# EAGLE design prize_delivery (EAGLE 9.6.2)
REV: 5
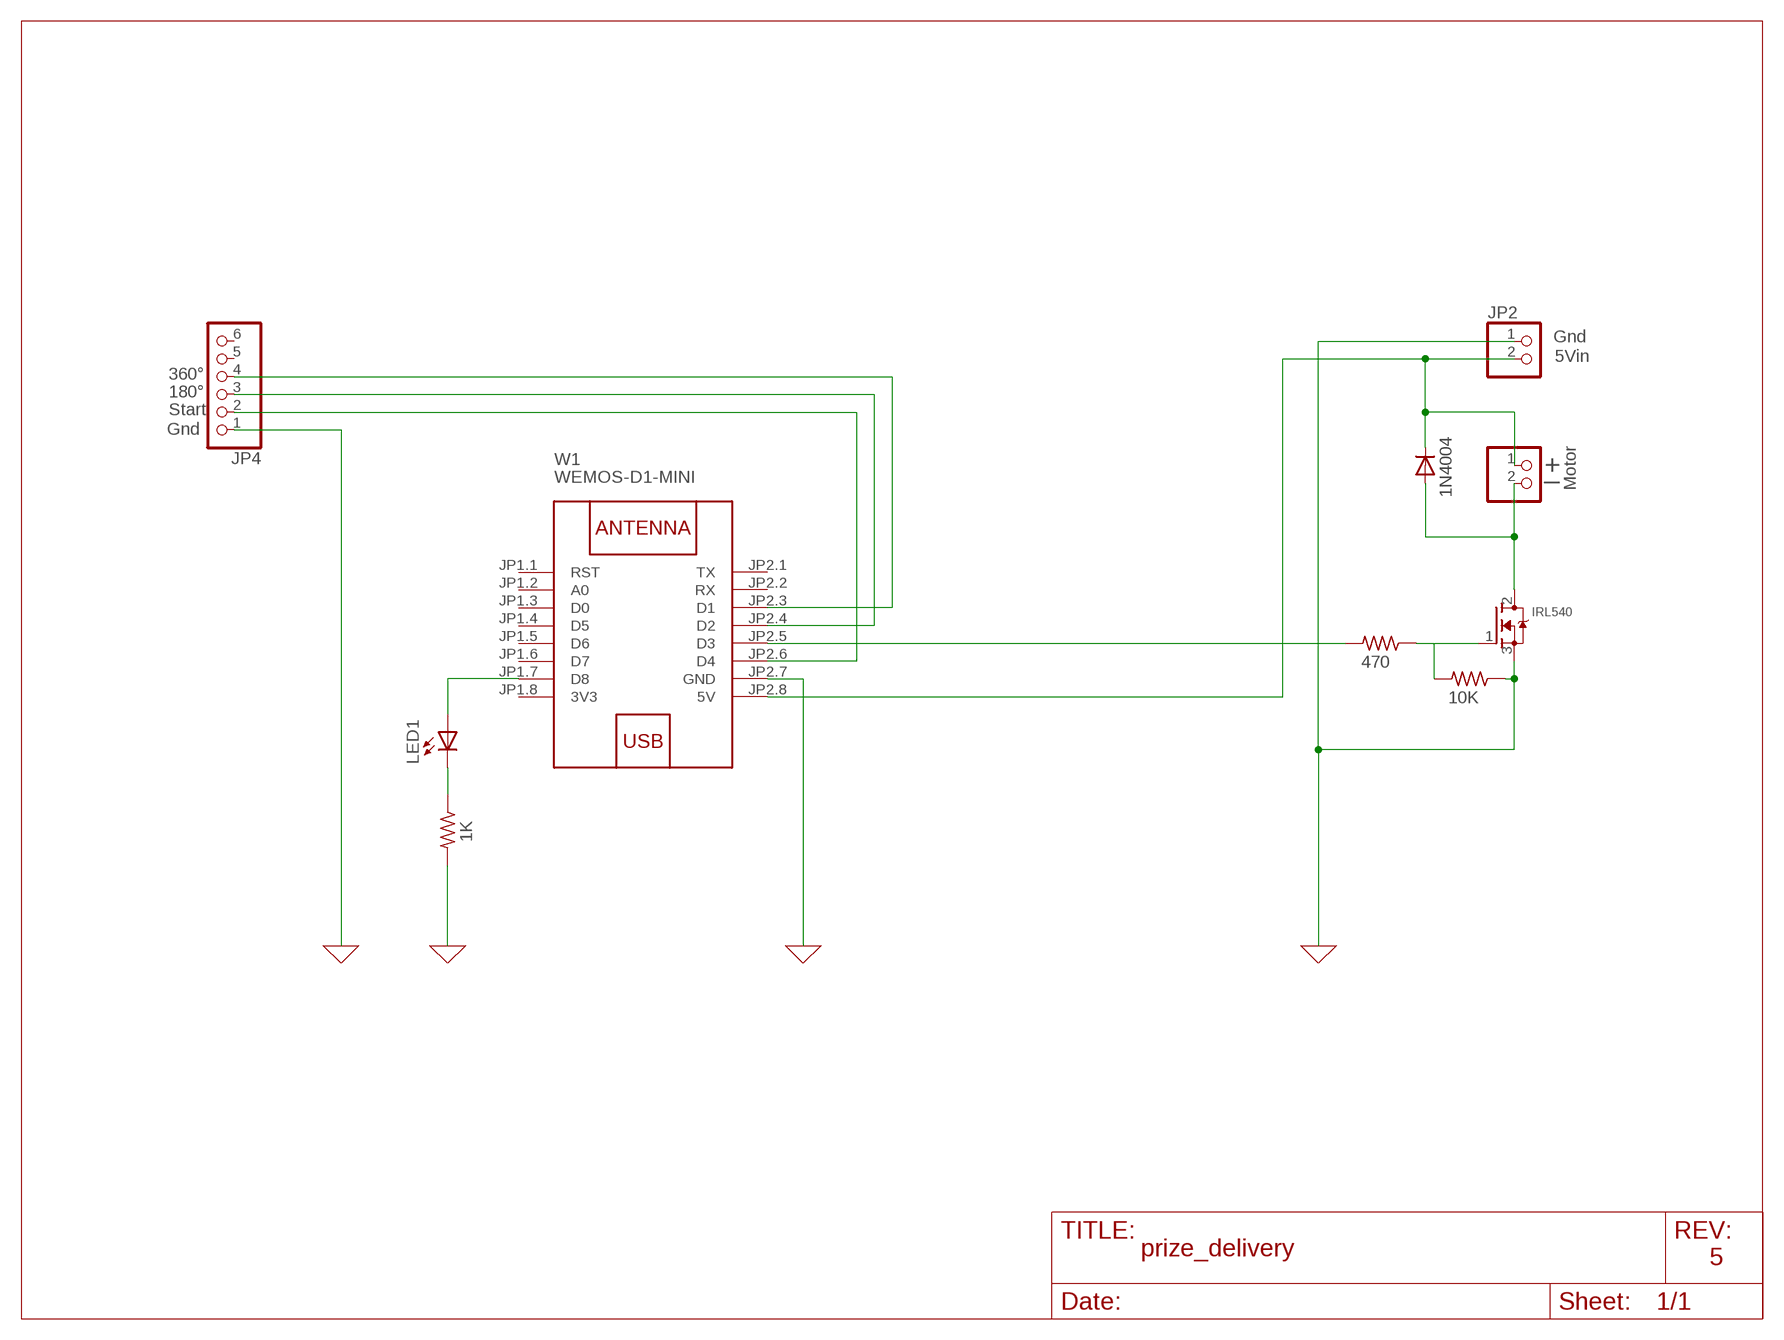
[diagram p0: schematic, sheet 1]

## Parts
D1  1N4004  [DO41-10]
JP2  5Vin  PINHD-1X2  [1X02]
JP3  Motor  PINHD-1X2  [1X02]
JP4  PINHD-1X6  [1X06]
LED1  LED5MM  [LED5MM]
Q1  IRL540  MOSFET-NGDS_TO220V  [TO220V]
R1  1K  R-US_0207/10  [0207/10]
R2  470  R-US_0207/10  [0207/10]
R4  10K  R-US_0207/10  [0207/10]
W1  WEMOS-D1-MINI  [WEMOS-D1-MINI]

## Nets
0: JP2.1 JP4.1 Q1.3(S) R1.2 R4.1 W1.JP2.7(GND) ; supply symbol labelled GND
N$1: R2.2 W1.JP2.5(D3)
N$2: D1.A JP3.2 Q1.2(D)
N$3: D1.C JP2.2 JP3.1 W1.JP2.8(5V)
N$4: JP4.3 W1.JP2.4(D2)
N$5: JP4.4 W1.JP2.3(D1)
N$6: LED1.A W1.JP1.7(D8)
N$7: LED1.K(C) R1.1
N$9: JP4.2 W1.JP2.6(D4)
N$14: Q1.1(G) R2.1 R4.2
Unconnected: JP4.5 JP4.6 W1.JP1.1(RST) W1.JP1.2(A0) W1.JP1.3(D0) W1.JP1.4(D5) W1.JP1.5(D6) W1.JP1.6(D7) W1.JP2.1(TX) W1.JP2.2(RX)

## Notes on the sheet
- Gnd
- 360°
- 180°
- Start
- Gnd
- _ | +
- 5

## Power pins joined to a net without a drawn wire
3V3: W1.JP1.8(3V3)

## Library data of the parts
D1 = adafruit:1N4004: DIODE General purpose 1N400x type rectifier (With bigger pads) http://www.ladyada.net/library/pcb/eaglelibrary.html
JP2 JP3 = pinhead:PINHD-1X2: PIN HEADER
JP4 = adafruit:PINHD-1X6: PIN HEADER
LED1 = adafruit:LED: LED OSRAM: - CHIPLED LG R971, LG N971, LY N971, LG Q971, LY Q971, LO R971, LY R971 LH N974, LH R974 LS Q976, LO Q976, LY Q976 LO Q996 - Hyper CHIPLED LW Q18S LB Q993, LB Q99A, LB R99A - SideLED LS A670, LO A670, LY A670, LG A670, LP A670 LB A673, LV A673, LT A673, LW A673 LH A674 LY A675 LS A676, LA A676, LO A676, LY A676, LW A676 LS A679, LY A679, LG A679 - Hyper Micro SIDELED® LS Y876, LA Y876, LO Y876, LY Y876 LT Y87S - SmartLED LW L88C, LW L88S LB L89C, LB L89S, LG L890 LS L89K, LO L89K, LY L89K LS L896, LA L896, LO L896, LY L896 - TOPLED LS T670, LO T670, LY T670, LG T670, LP T670 LSG T670, LSP T670, LSY T670, LOP T670, LYG T670 LG T671, LOG T671, LSG T671 LB T673, LV T673, LT T673, LW T673 LH T674 LS T676, LA T676, LO T676, LY T676, LB T676, LH T676, LSB T676, LW T676 LB T67C, LV T67C, LT T67C, LS T67K, LO T67K, LY T67K, LW E67C LS E67B, LA E67B, LO E67B, LY E67B, LB E67C, LV E67C, LT E67C LW T67C LS T679, LY T679, LG T679 LS T770, LO T770, LY T770, LG T770, LP T770 LB T773, LV T773, LT T773, LW T773 LH T774 LS E675, LA E675, LY E675, LS T675 LS T776, LA T776, LO T776, LY T776, LB T776 LHGB T686 LT T68C, LB T68C - Hyper Mini TOPLED® LB M676 - Mini TOPLED Santana® LG M470 LS M47K, LO M47K, LY M47K Source: http://www.osram.convergy.de/
Q1 = adafruit:MOSFET-N: N-Channel Mosfet 2N7002E - 60V 260mA SOT23 [Digikey: 2N7002ET1GOSTR-ND] - REEL BSH103 - 30V 850mA SOT23 [Digikey: 568-5013-1-ND]
R1 R2 R4 = adafruit:R-US_: RESISTOR, American symbol
W1 = diy-modules:WEMOS-D1-MINI: WEMOS D1 mini: Mini Wi-Fi Board based on ESP-8266 device More details can be found here: https://www.wemos.cc/product/d1-mini.html Click here to find device on ebay.com <http://www.ebay.com/sch/wemos+d1+mini+nodemcu>

## Board
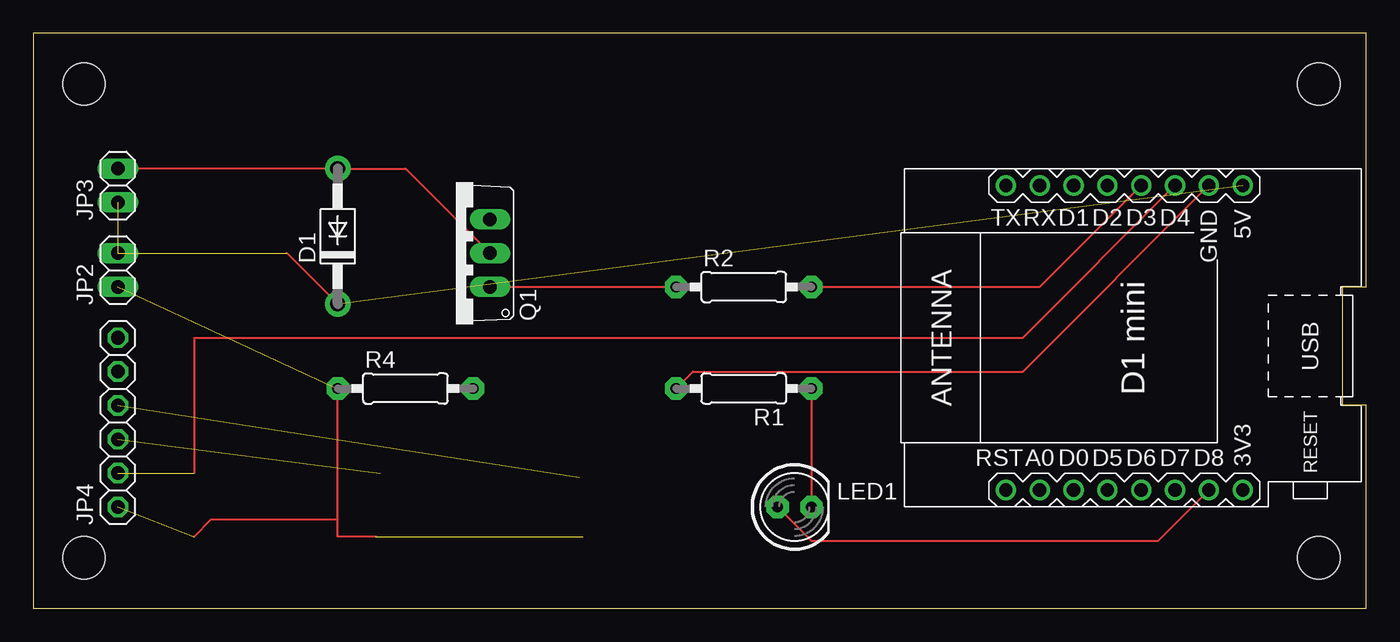
[diagram p1: board, top side]
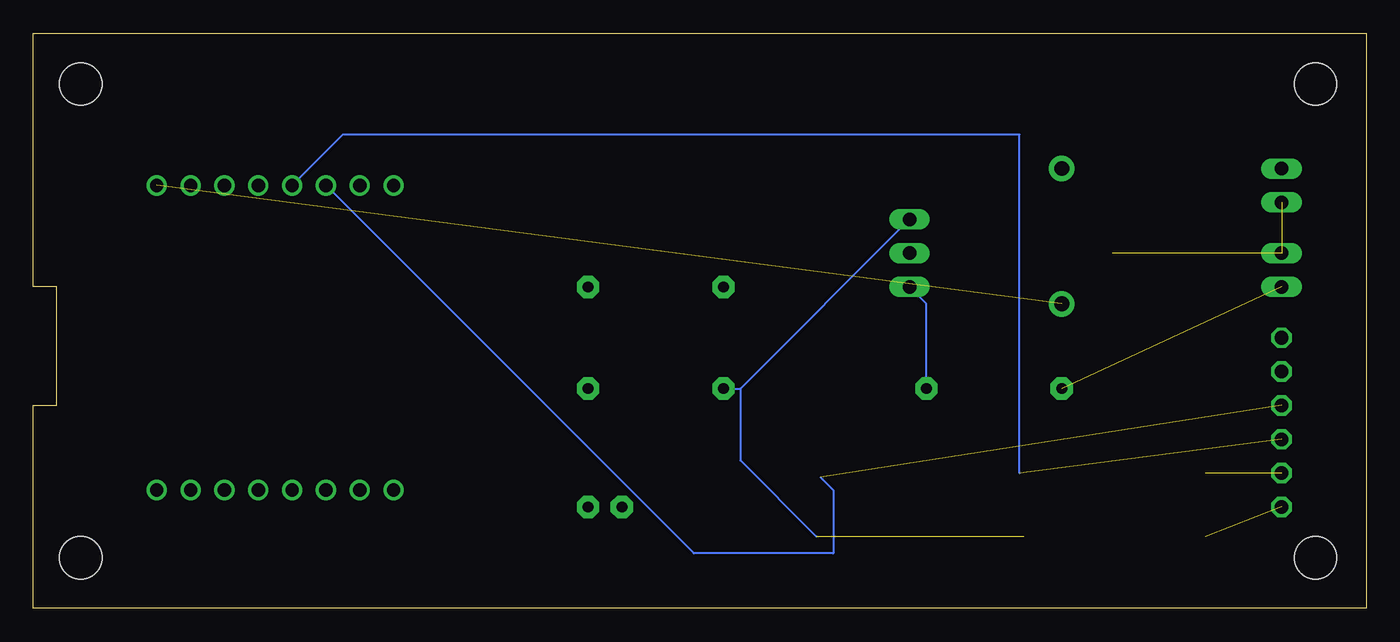
[diagram p2: board, bottom side, seen from below]

Size 100.08 x 43.17 mm. Coordinates in mm from the lower left corner, seen from the top.
Outline: 0,0 100.08,0 100.08,15.24 98.3,15.24 98.3,24.13 100.08,24.13 100.08,43.17 0,43.17 0,0
Copper layers (1*16): Top 0.035mm / dielectric 1.5mm / Bottom 0.035mm
Design rules "default": minimum track width 6mil, minimum drill 0.35mm, track to track 6mil, track to pad 6mil, pad to pad 6mil, via to via 6mil, smd to smd 6mil, copper to edge 40mil, drill to drill 6mil, minimum pad ring 10mil, minimum via ring 8mil, stop-mask expansion 4mil, vias tented up to drill 0mil, thermal gap 10mil
Holes 3.17 mm at 3.81,39.37 3.81,3.81 96.52,3.81 96.52,39.37

### Footprints (pad centres in the part's own frame; a part is rotated, then mirrored left to right if it is on the bottom)
DO41-10 = drill 1.118 pad 1.93: A 5.08,0; C -5.08,0
1X02 = drill 1.016 long: 1 -1.27,0; 2 1.27,0
1X06 = drill 1.016 octagon: 1 -6.35,0; 2 -3.81,0; 3 -1.27,0; 4 1.27,0; 5 3.81,0; 6 6.35,0
LED5MM = drill 0.813 pad 1.676 octagon: A -1.27,0; K 1.27,0
TO220V = drill 1.016 long: 1 -2.54,-2.54; 2 0,-2.54; 3 2.54,-2.54
0207/10 = drill 0.813 pad 1.676 octagon: 1 -5.08,0; 2 5.08,0
WEMOS-D1-MINI = drill 1: JP1.1 -11.43,9.525; JP1.2 -11.43,6.985; JP1.3 -11.43,4.445; JP1.4 -11.43,1.905; JP1.5 -11.43,-0.635; JP1.6 -11.43,-3.175; JP1.7 -11.43,-5.715; JP1.8 -11.43,-8.255; JP2.1 11.43,9.525; JP2.2 11.43,6.985; JP2.3 11.43,4.445; JP2.4 11.43,1.905; JP2.5 11.43,-0.635; JP2.6 11.43,-3.175; JP2.7 11.43,-5.715; JP2.8 11.43,-8.255

### Placement (x,y rotation side)
D1  22.86,27.94 90 top
JP2  6.35,25.4 90 top
JP3  6.35,31.75 90 top
JP4  6.35,13.97 90 top
LED1  57.15,7.62 0 top
Q1  31.75,26.67 90 top
R1  53.34,16.51 180 top
R2  53.34,24.13 0 top
R4  27.94,16.51 0 top
W1  82.55,20.32 90 top

### Tracks (layer width: path | path; a pad name or v marks a point on that pad's centre or on a via)
0  (3 unrouted)
  Top 0.152: 22.86,6.67 22.86,5.4 25.72,5.4 | 22.86,6.67 R4.1 | 12.06,5.4 13.34,6.67 22.86,6.67 | W1.JP2.7 74.3,17.78 49.53,17.78 R1.2
  Bottom 0.152: 46.99,16.51 Q1.3 | R1.2 46.99,16.51 | 41.27,5.4 46.99,11.11 46.99,16.51
N$1
  Top 0.152: W1.JP2.5 75.56,24.13 R2.2
N$2
  Top 0.152: Q1.2 27.94,33.02 D1.A JP3.2
N$3  (3 unrouted)
  Top 0.152: 19.05,26.67 D1.C
N$4  (1 unrouted)
  Bottom 0.152: W1.JP2.4 76.83,35.56 26.04,35.56 26.04,10.16
N$5  (1 unrouted)
  Bottom 0.152: W1.JP2.3 50.48,4.13 40.01,4.13 40.01,8.89 40.96,9.84
N$6
  Top 0.152: W1.JP1.7 84.45,5.08 58.42,5.08 LED1.A
N$7
  Top 0.152: R1.1 LED1.K
N$9  (1 unrouted)
  Top 0.152: W1.JP2.6 74.3,20.32 12.06,20.32 12.06,10.16
N$14
  Top 0.152: Q1.1 R2.1
  Bottom 0.152: Q1.1 33.02,22.86 R4.2